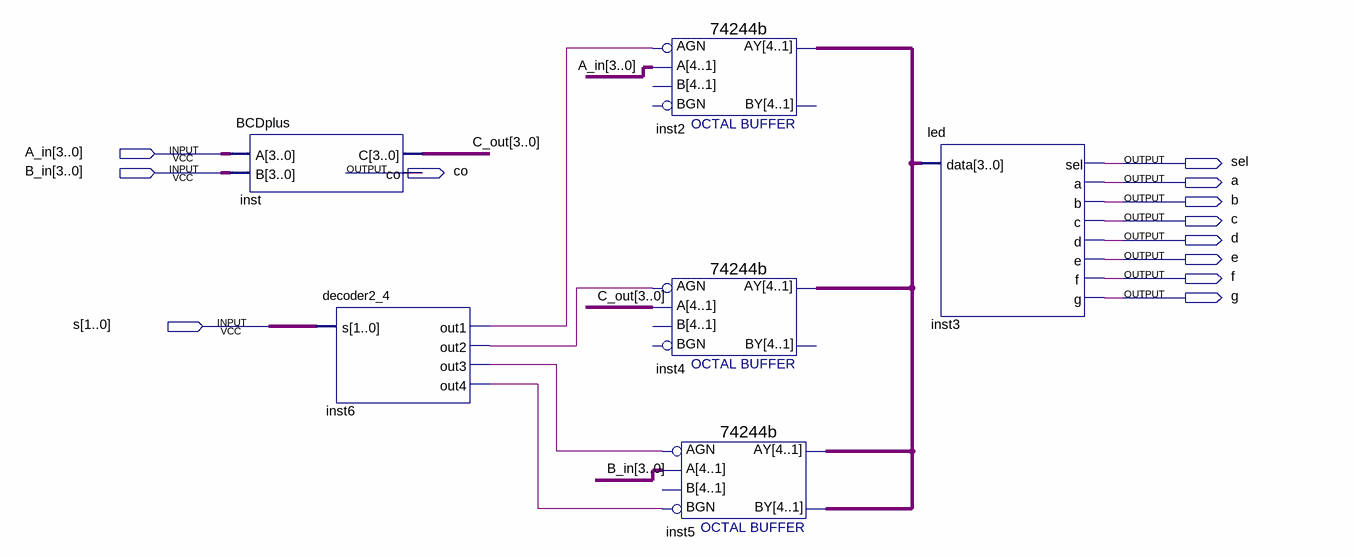
[diagram p0: schematic sheet]
// Quartus schematic project4.bdf as structural Verilog: 6 symbols, 12 pins
module project4 (
  input  [3:0] A_in,
  input  [3:0] B_in,
  input  [1:0] s,
  output sel,
  output co,
  output a,
  output b,
  output c,
  output d,
  output e,
  output f,
  output g
);

  wire inst6_out1, inst6_out2, inst6_out3, inst6_out4;
  wire [3:0] C_out, inst2_ay;

  BCDplus inst (.A(A_in), .B(B_in), .C(C_out), .co(co));
  decoder2_4 inst6 (.s(s), .out1(inst6_out1), .out2(inst6_out2), .out3(inst6_out3), .out4(inst6_out4));
  \74244b  inst2 (.AGN(inst6_out1), .A(A_in), .AY(inst2_ay));  // open: B, BGN, BY
  \74244b  inst4 (.AGN(inst6_out2), .A(C_out), .AY(inst2_ay));  // open: B, BGN, BY
  \74244b  inst5 (.AGN(inst6_out3), .BGN(inst6_out4), .A(B_in), .AY(inst2_ay), .BY(inst2_ay));  // open: B
  led inst3 (.data(inst2_ay), .sel(sel), .a(a), .b(b), .c(c), .d(d), .e(e), .f(f), .g(g));
endmodule
